# Altium schematic sheet Esquematico.SchDoc
size A4
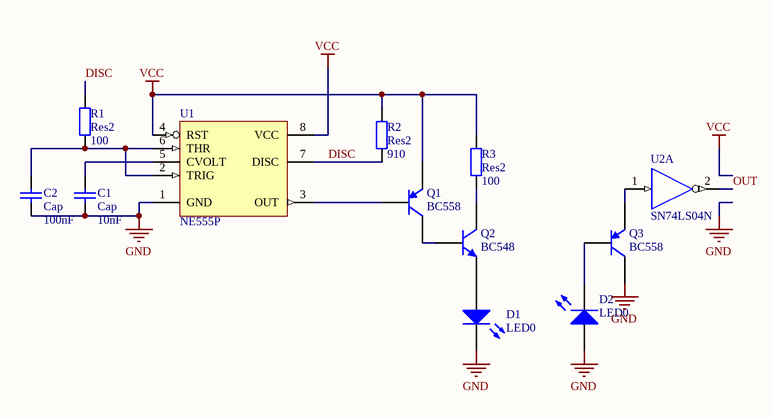
[diagram p0: Esquematico.SchDoc]

## Parts
C1  Cap  value 10nF  [RAD-0.2]
C2  Cap  value 100nF  [RAD-0.2]
D1  LED0  [LED]
D2  LED0  [LED]
Q1  BC558  [TO-92]
Q2  BC548  [TO-92]
Q3  BC558  [TO-92]
R1  Res2  value 100  [AXIAL-0.4]
R2  Res2  value 910  [AXIAL-0.4]
R3  Res2  value 100  [AXIAL-0.4]
U1  NE555P  [P008]
U2  SN74LS04N  [N014]  (part A of 6)

## Nets
GND: C1.1 C2.1 D1.2(K) D2.1(A) Q3.3(C) U1.1(GND) U2.7(GND)
VCC: Q1.1(E) R2.2 R3.2 U1.4(RST) U1.8(VCC) U2.14(VCC)
DISC: R1.2 R2.1 U1.7(DISC)
OUT: U2.2(Y)
NetC1_2: C1.2 U1.5(CVOLT)
NetC2_2: C2.2 R1.1 U1.2(TRIG) U1.6(THR)
NetD1_1: D1.1(A) Q2.1(E)
NetD2_2: D2.2(K) Q3.2(B)
NetQ1_2: Q1.2(B) U1.3(OUT)
NetQ1_3: Q1.3(C) Q2.2(B)
NetQ2_3: Q2.3(C) R3.1
NetQ3_1: Q3.1(E) U2.1(A)

## Library data of the parts
C1 C2 = Cap: Capacitor; Published: 8-Jun-2000; LatestRevisionDate: 17-Jul-2002; LatestRevisionNote: Re-released for DXP Platform.; PackageReference: RAD-0.3; Publisher: Altium Limited; PackageDescription: Radial Cap, Thru-Hole; 2 Leads; 0.3 in Pin Spacing
D1 D2 = LED0: Typical INFRARED GaAs LED; pin to pad: 1>A 2>K; Published: 8-Jun-2000; LatestRevisionDate: 08-Jul-2005; LatestRevisionNote: Mech Layer 1 removed.; PackageReference: LED-0; Publisher: Altium Limited; PackageDescription: LED; 2 Leads
Q1 Q3 = BC558: PNP Bipolar Transistor; Published: 8-Jun-2000; LatestRevisionDate: 29-May-2009; LatestRevisionNote: IPC-7351 Footprint Added.; PackageVersion: Aug-1999; PackageReference: SOT-23B; Publisher: Altium Limited; PackageDescription: 3-Pin SOT-23 Package 0.95 mm Pitch, 2.4 mm Lead Span
Q2 = BC548: NPN General Purpose Amplifier; Published: 8-Jun-2000; LatestRevisionDate: 15-Jan-2003; LatestRevisionNote: PCB Footprint 'BCY-W3/D4.7' replaced; DatasheetVersion: 1997; PackageVersion: Sep-1998; PackageReference: TO-92A; Publisher: Altium Limited; PackageDescription: TO, Flat Index; 3 In-Line, Axial Leads; Body Dia. 4.5mm; Leads 0.51 x 0.48 mm (max); ComponentLink1Description: Manufacturer Link; ComponentLink1URL: http://www.fairchildsemi.com/; ComponentLink2Description: Datasheet; ComponentLink2URL: http://www.fairchildsemi.com/ds/2N%2F2N3904.pdf
R1-R3 = Res2: Resistor; Published: 8-Jun-2000; LatestRevisionDate: 17-Jul-2002; LatestRevisionNote: Re-released for DXP Platform.; PackageReference: AXIAL-0.4; Publisher: Altium Limited; PackageDescription: Axial Device, Thru-Hole; 2 Leads; 0.4 in Pin Spacing
U1 = NE555P: Precision Timer; Published: 16-Jan-2001; LatestRevisionDate: 04-Mar-2005; LatestRevisionNote: Stylized 3D Model Added.; DatasheetVersion: Feb-1992; PackageVersion: Jun-1999; PackageReference: P008; Publisher: Altium Limited; PackageDescription: DIP; 8 Leads; Row Spacing 7.62 mm; Pitch 2.54 mm; Code_JEDEC: MO-001-AN; ComponentLink1Description: Manufacturer Link; ComponentLink1URL: http://www.ti.com/; ComponentLink2Description: Datasheet; ComponentLink2URL: http://www-s.ti.com/sc/ds/ne555.pdf
U2 = SN74LS04N: Hex Inverter; Published: 8-Jun-2000; LatestRevisionDate: 04-Mar-2005; LatestRevisionNote: Stylized 3D Model Added.; DatasheetVersion: Mar-1988; PackageVersion: Oct-1995; PackageReference: N014; Publisher: Altium Limited; PackageDescription: DIP; 14 Leads; Row Spacing 7.62 mm; Pitch 2.54 mm; ComponentLink1Description: Manufacturer Link; ComponentLink1URL: http://www.ti.com/; ComponentLink2Description: Datasheet; ComponentLink2URL: http://www-s.ti.com/sc/ds/sn74ls04.pdf